# EAGLE design light_sensor (EAGLE 5.12)
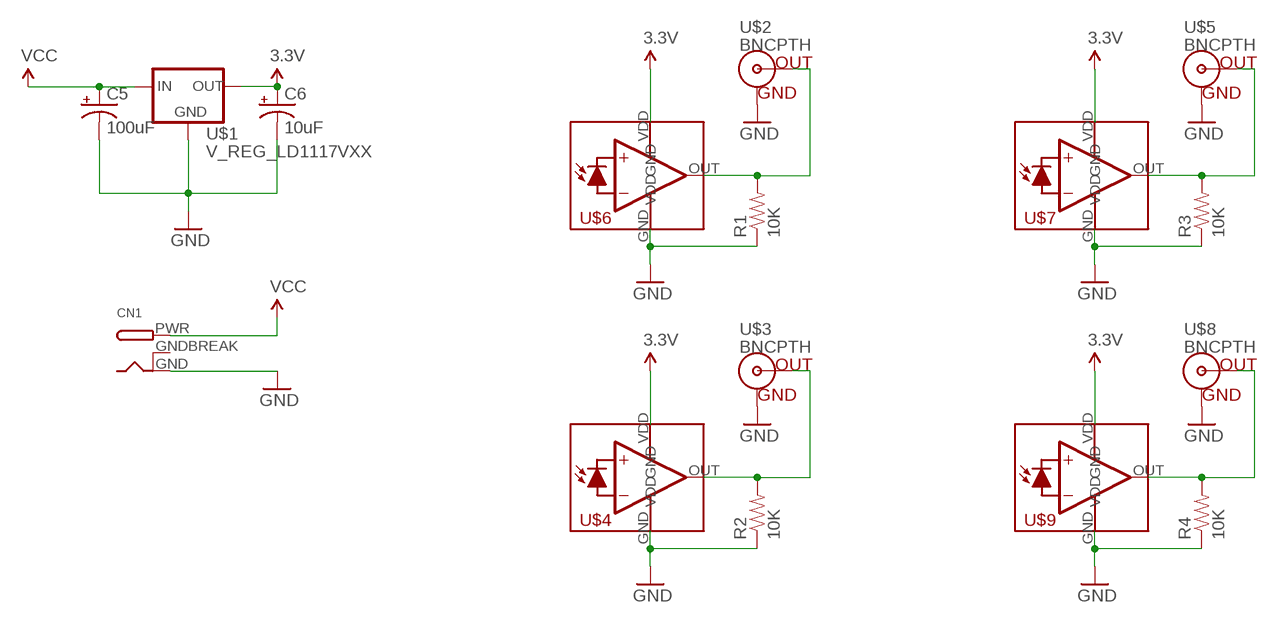
[diagram p0: schematic, sheet 1]

## Parts
C5  100uF  CAP_POLPTH1  [CPOL-RADIAL-100UF-25V]
C6  10uF  CAP_POLPTH2  [CPOL-RADIAL-10UF-25V]
CN1  DCBARRELPTH  [DCJACK_2MM_PTH]
R1  10K  RESISTORAXIAL-0.3  [AXIAL-0.3]
R2  10K  RESISTORAXIAL-0.3  [AXIAL-0.3]
R3  10K  RESISTORAXIAL-0.3  [AXIAL-0.3]
R4  10K  RESISTORAXIAL-0.3  [AXIAL-0.3]
U$1  V_REG_LD1117VXX  [78XXL]
U$2  BNCPTH  [BNC]
U$3  BNCPTH  [BNC]
U$4  TSLXXS  [TSLS]
U$5  BNCPTH  [BNC]
U$6  TSLXXS  [TSLS]
U$7  TSLXXS  [TSLS]
U$8  BNCPTH  [BNC]
U$9  TSLXXS  [TSLS]

## Nets
3.3V: C6.1(+) U$1.GND(OUT) U$4.VDD U$6.VDD U$7.VDD U$9.VDD
GND: C5.2(-) C6.2(-) CN1.GND R1.P$1 R2.P$1 R3.P$1 R4.P$1 U$1.IN(GND) U$2.GND U$3.GND U$4.GND U$5.GND U$6.GND U$7.GND U$8.GND U$9.GND
N$1: R2.P$2 U$3.S(OUT) U$4.OUT
N$2: R1.P$2 U$2.S(OUT) U$6.OUT
N$3: R3.P$2 U$5.S(OUT) U$7.OUT
N$4: R4.P$2 U$8.S(OUT) U$9.OUT
VCC: C5.1(+) CN1.PWR U$1.OUT(IN)

## Power pins joined to a net without a drawn wire
GNDBREAK: CN1.GNDBREAK

## Library data of the parts
C5 C6 = SparkFun:CAP_POL: Capacitor Polarized These are standard SMD and PTH capacitors. Normally 10uF, 47uF, and 100uF in electrolytic and tantalum varieties. Always verify the external diameter of the through hole cap, it varies with capacity, voltage, and manufacturer. The EIA devices should be standard.
CN1 = adafruit:DCBARREL: 2.0mm DC Barrel Jack DCJACK_2MM_PTH - Through Hole Jack (4UConnector: 05537)
R1-R4 = SparkFun:RESISTOR: Resistor Basic schematic elements and footprints for 0603, 1206, and PTH resistors.
U$1 = SparkFun:V_REG_LD1117VXX: LD1117VXX voltage regulator. We carry the 3.3V version (COM-00526) in TO-220 package.
U$2 U$3 U$5 U$8 = SparkFun:BNC: BNC Connector, Mouser Part# 5227161
U$4 U$6 U$7 U$9 = light_sensor:TSLXXS

## Board
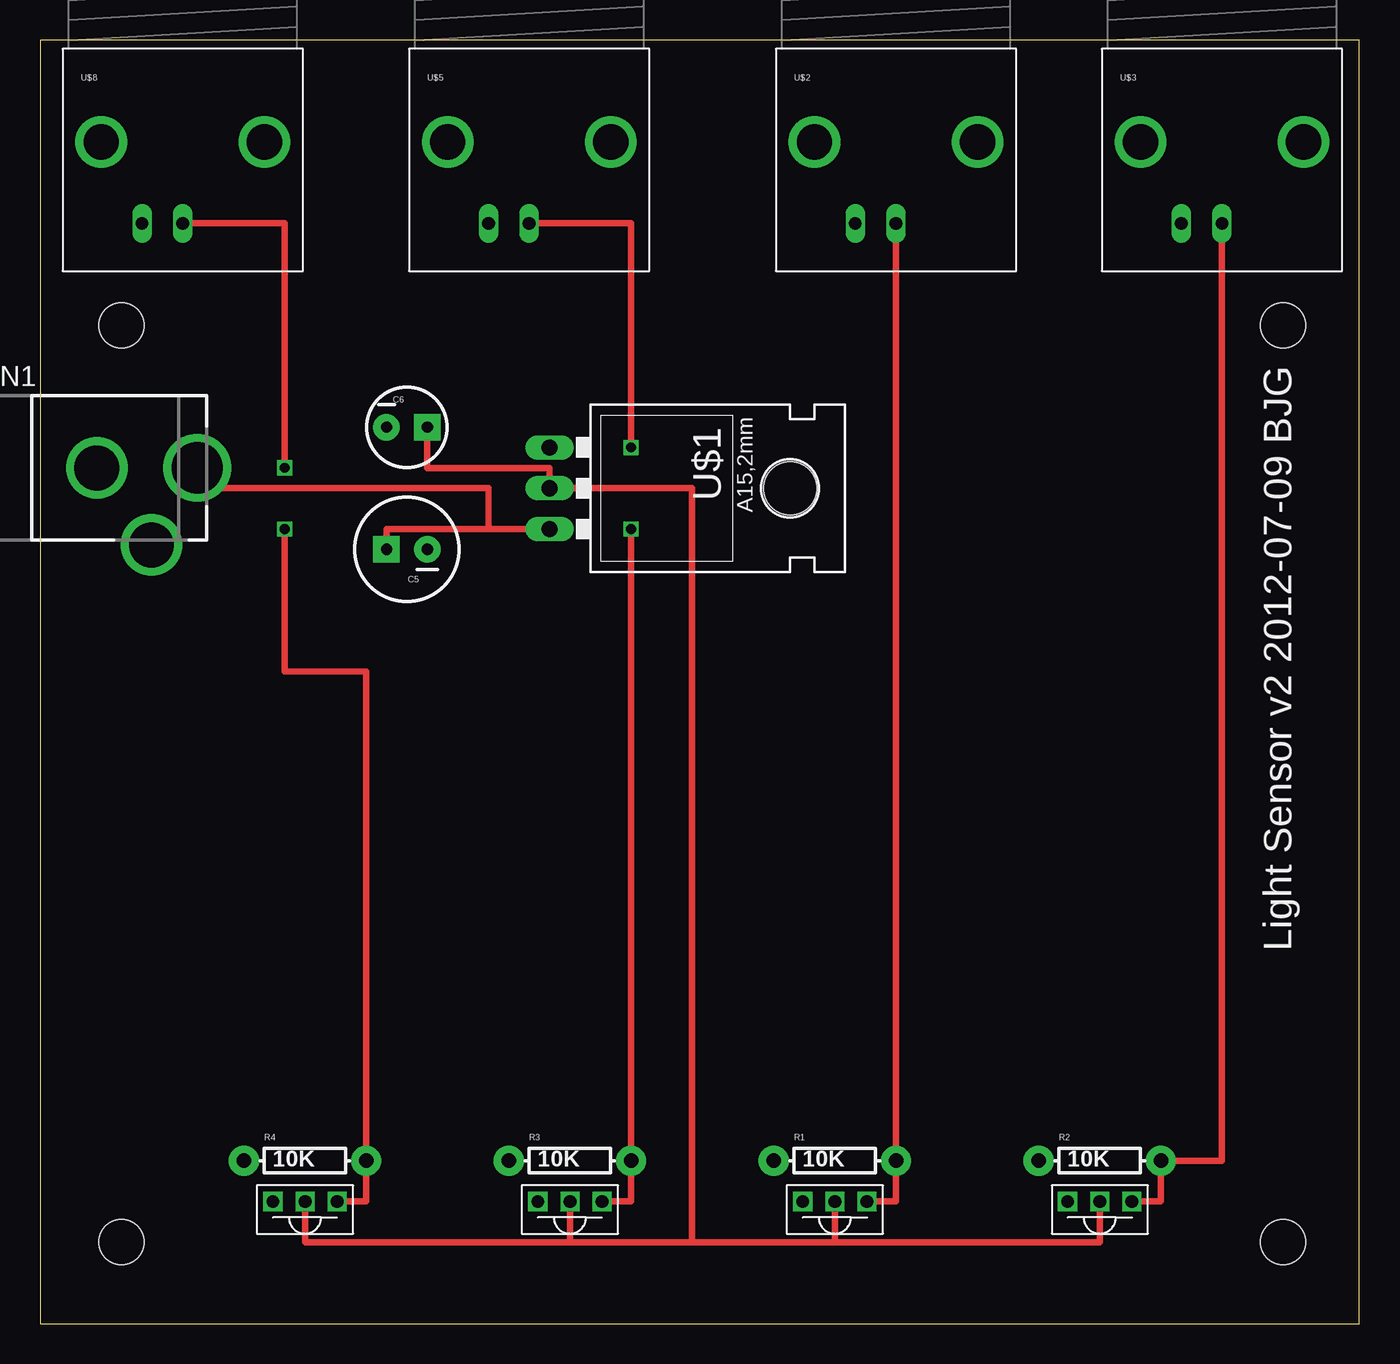
[diagram p1: board, top side]
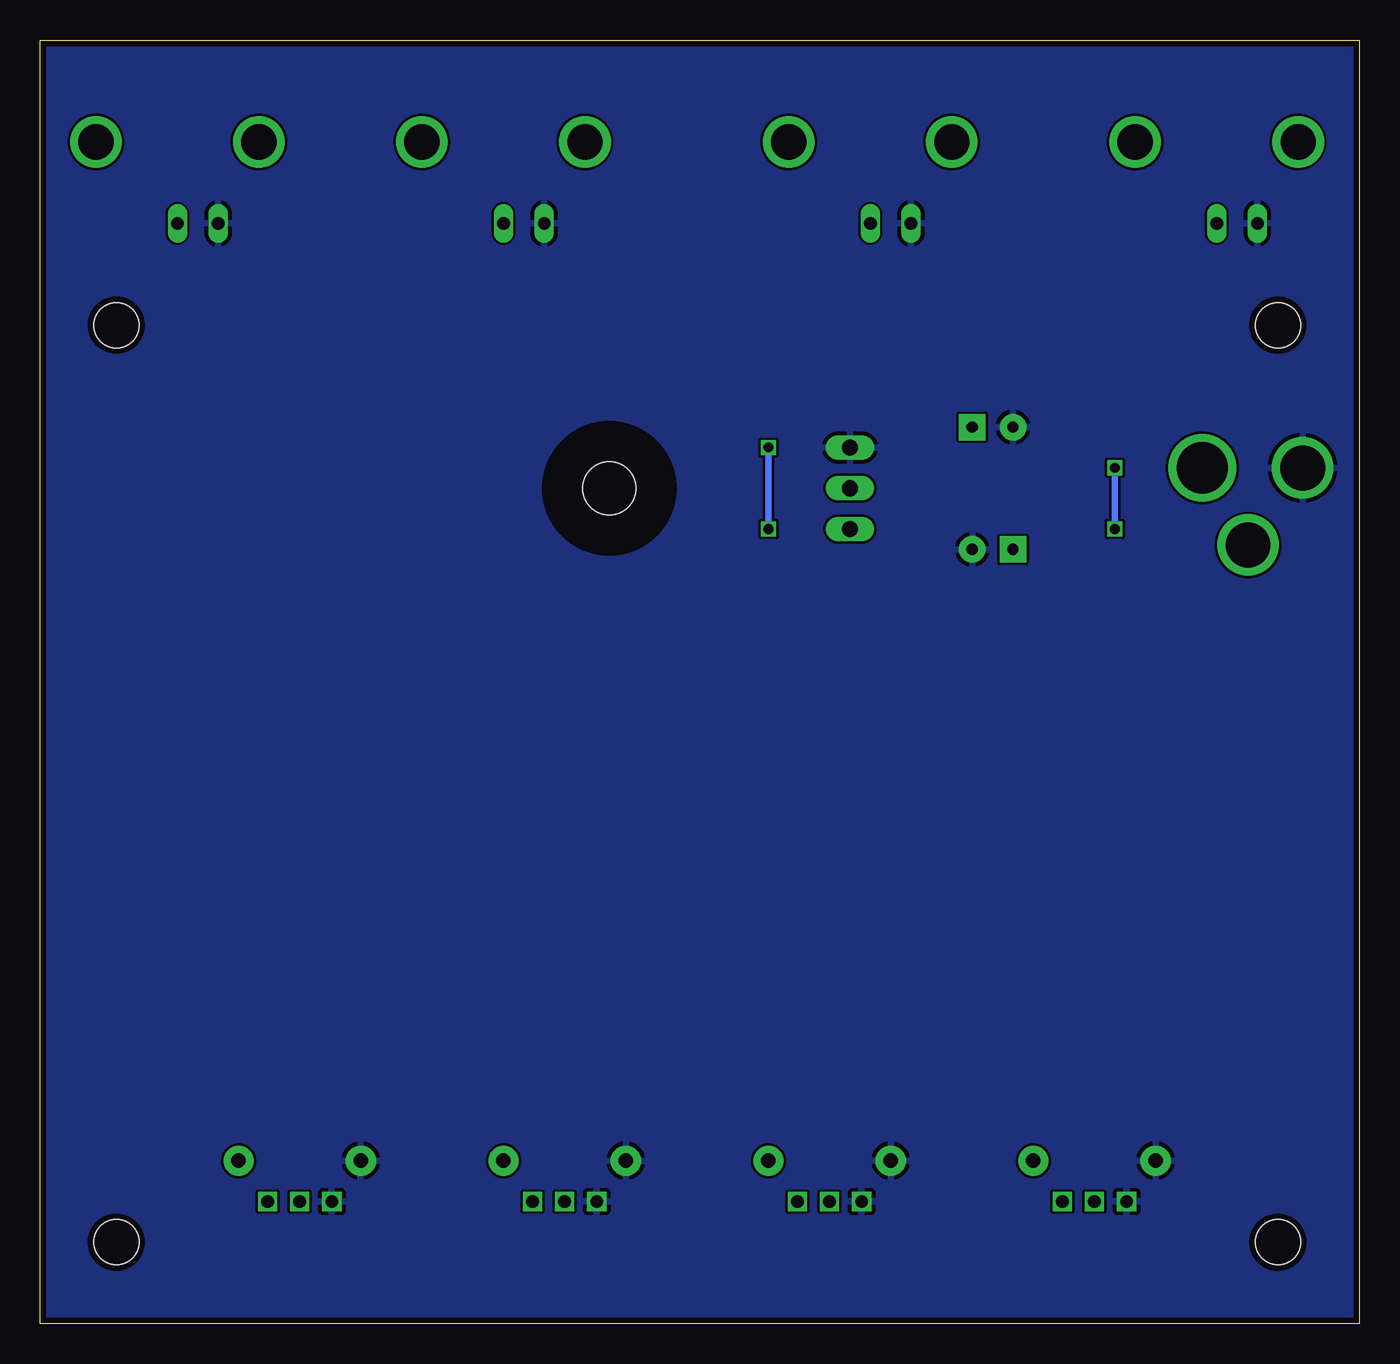
[diagram p2: board, bottom side, seen from below]

Size 82.22 x 80 mm. Coordinates in mm from the lower left corner, seen from the top.
Outline: 0,0 82.22,0 82.22,80 0,80 0,0
Copper layers (1*16): Top 0.0356mm / dielectric 1.5011mm / Bottom 0.0356mm
Design rules "LaenPCBOrder": minimum track width 6mil, minimum drill 13mil, track to track 6mil, track to pad 6mil, pad to pad 6mil, via to via 6mil, smd to smd 6mil, copper to edge 15mil, drill to drill 6mil, minimum pad ring 7mil, minimum via ring 7mil, stop-mask expansion 4mil, vias tented up to drill 0mil, thermal gap 10mil
Holes 2.8 mm at 5.08,5.08 5.08,62.23 77.47,62.23 77.47,5.08

### Footprints (pad centres in the part's own frame; a part is rotated, then mirrored left to right if it is on the bottom)
CPOL-RADIAL-100UF-25V = drill 0.7 pad 1.651 square: 1 1.27,0 | drill 0.7 pad 1.651 round: 2 -1.27,0
CPOL-RADIAL-10UF-25V = drill 0.7 pad 1.651 square: 1 1.27,0 | drill 0.7 pad 1.651 round: 2 -1.27,0
DCJACK_2MM_PTH = drill 2.8 round: GND 0,7.35; GNDBREAK 4.8,10.75 | drill 3.2 round: PWR 0,13.6
AXIAL-0.3 = drill 0.9 pad 1.88 round: P$1 -3.81,0; P$2 3.81,0
78XXL = drill 1.016 long: GND 0,-3.81; IN -2.54,-3.81; OUT 2.54,-3.81 | hole 3.302: 0,11.176
BNC = drill 2.2 round: 3 -5.08,5.08; 4 5.08,5.08 | drill 0.8 long: GND -2.54,0; S 0,0
TSLS = drill 0.8 square: GND -2,0; OUT 2,0; VDD 0,0

### Placement (x,y rotation side)
C5  22.86,48.26 180 top
C6  22.86,55.88 0 top
CN1  -3.81,53.34 270 top
R1  49.53,10.16 0 top
R2  66.04,10.16 0 top
R3  33.02,10.16 0 top
R4  16.51,10.16 0 top
U$1  35.56,52.07 270 top
U$2  53.34,68.58 0 top
U$3  73.66,68.58 0 top
U$4  66.04,7.62 0 top
U$5  30.48,68.58 0 top
U$6  49.53,7.62 0 top
U$7  33.02,7.62 0 top
U$8  8.89,68.58 0 top
U$9  16.51,7.62 0 top

### Tracks (layer width: path | path; a pad name or v marks a point on that pad's centre or on a via)
3.3V
  Top 0.406: C6.1 24.13,53.34 31.75,53.34 U$1.GND 40.64,52.07 40.64,5.08 | U$9.VDD 16.51,5.08 33.02,5.08 | 33.02,5.08 U$7.VDD | 33.02,5.08 40.64,5.08 | 40.64,5.08 49.53,5.08 | 49.53,5.08 U$6.VDD | 49.53,5.08 66.04,5.08 U$4.VDD
GND
  pour Bottom: 0,80.01 0,0 82.55,0 82.55,80.01
N$1
  Top 0.406: U$4.OUT 69.85,7.62 R2.P$2 73.66,10.16 U$3.S
N$2
  Top 0.406: U$6.OUT 53.34,7.62 R1.P$2 U$2.S
N$3  (via drill 0.6)
  Top 0.406: U$7.OUT 36.83,7.62 R3.P$2 v36.83,49.53 | v36.83,54.61 36.83,68.58 U$5.S
  Bottom 0.406: v36.83,49.53 v36.83,54.61
N$4  (via drill 0.6)
  Top 0.406: U$9.OUT 20.32,7.62 R4.P$2 20.32,40.64 15.24,40.64 v15.24,49.53 | v15.24,53.34 15.24,68.58 U$8.S
  Bottom 0.406: v15.24,49.53 v15.24,53.34
VCC
  Top 0.406: CN1.PWR 9.79,52.07 27.94,52.07 27.94,49.53 U$1.OUT 21.59,49.53 C5.1

### Text on the board
tPlace: Light Sensor v2 2012-07-09 BJG